# EAGLE design drone_parachute (EAGLE 9.5.0)
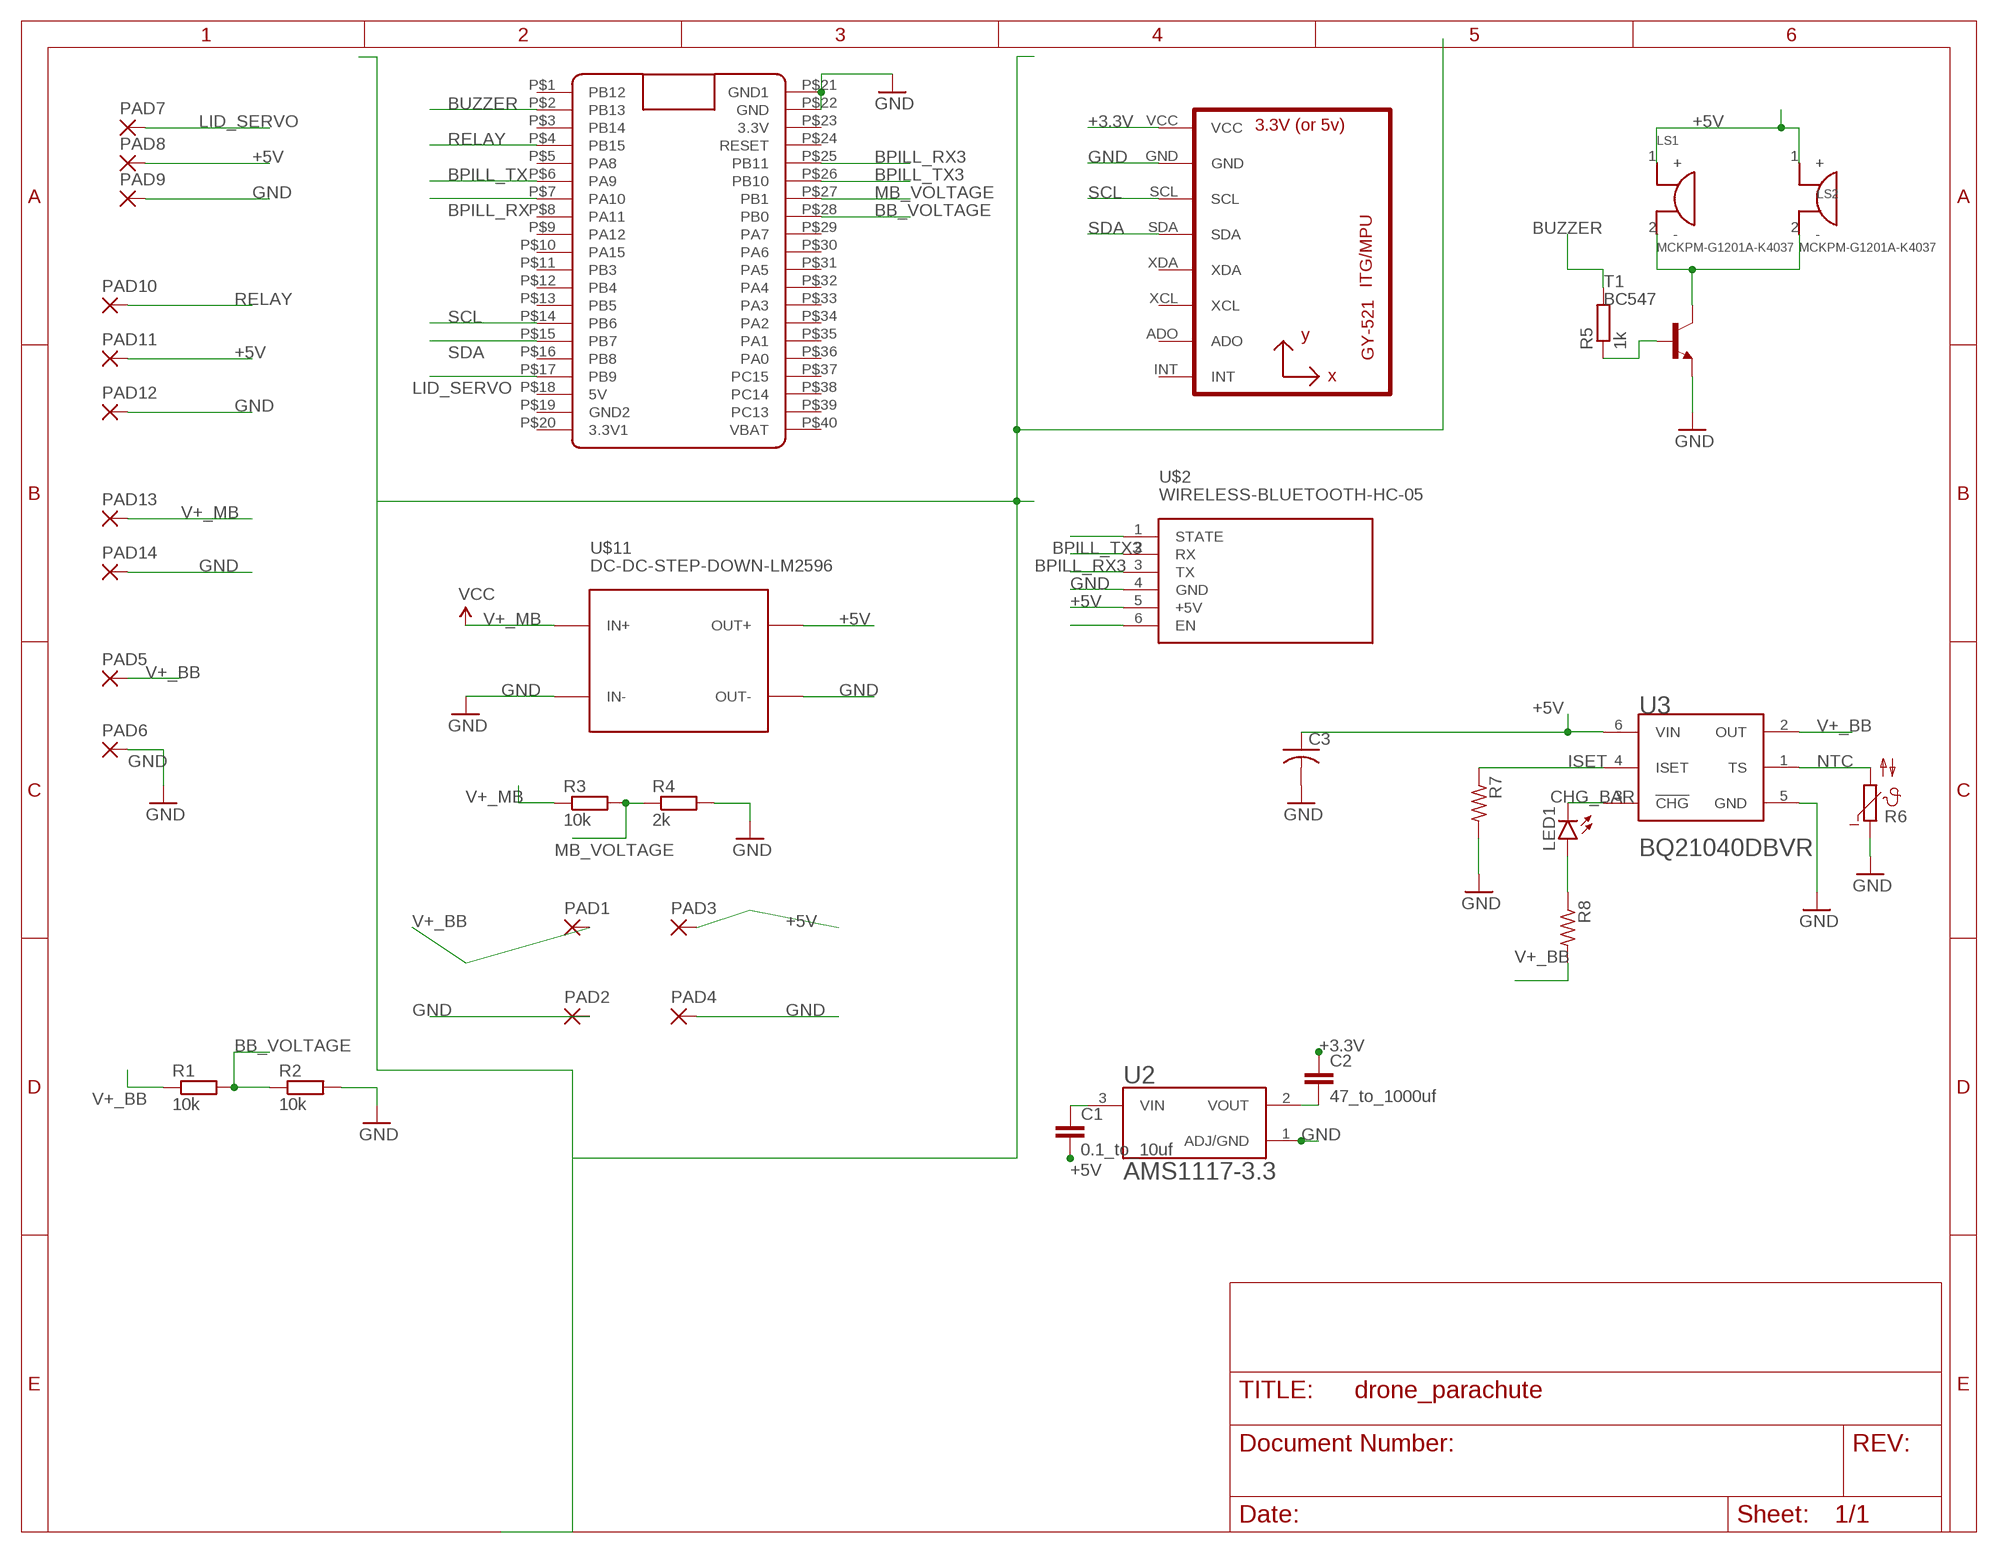
[diagram p0: schematic, sheet 1]

## Parts
C1  0.1_to_10uf  C-EU025-025X050  [C025-025X050]
C2  47_to_1000uf  C-EU025-025X050  [C025-025X050]
C3  C-USC0805  [C0805]
LED1  LEDCHIP-LED0805  [CHIP-LED0805]
LS1  MCKPM-G1201A-K4037  [XDCR_MCKPM-G1201A-K4037]
LS2  MCKPM-G1201A-K4037  [XDCR_MCKPM-G1201A-K4037]
PAD1  1,6/0,8  [1,6/0,8]
PAD2  1,6/0,8  [1,6/0,8]
PAD3  1,6/0,8  [1,6/0,8]
PAD4  1,6/0,8  [1,6/0,8]
PAD5  1,6/0,8  [1,6/0,8]
PAD6  1,6/0,8  [1,6/0,8]
PAD7  1,6/0,8  [1,6/0,8]
PAD8  1,6/0,8  [1,6/0,8]
PAD9  1,6/0,8  [1,6/0,8]
PAD10  1,6/0,8  [1,6/0,8]
PAD11  1,6/0,8  [1,6/0,8]
PAD12  1,6/0,8  [1,6/0,8]
PAD13  1,6/0,8  [1,6/0,8]
PAD14  1,6/0,8  [1,6/0,8]
R1  10k  R-EU_0204/7  [0204/7]
R2  10k  R-EU_0204/7  [0204/7]
R3  10k  R-EU_0204/7  [0204/7]
R4  2k  R-EU_0204/7  [0204/7]
R5  1k  R-EU_0204/7  [0204/7]
R6  NTC640  [P640]
R7  R-US_R0805  [R0805]
R8  R-US_R0805  [R0805]
T1  BC547  [TO92]
U1  GY-521MPU6050  [GY-521]
U2  AMS1117-3.3  [SOT229P700X180-4N]
U3  TEXAS_INSTRUMENTS_BQ21040DBVRTEXAS_INSTRUMENTS_BQ21040DBVR_0_0  [TEXAS_INSTRUMENTS_BQ21040DBVR_0]
U$1  BLUE_PILL  [BLUE_PILL]
U$2  WIRELESS-BLUETOOTH-HC-05  [WIRELESS-BLUETOOTH-HC-05]
U$11  DC-DC-STEP-DOWN-LM2596  [DC-DC-STEP-DOWN-LM2596]

## Nets
+3.3V: C2.1 U1.VCC
+5V: C1.2 C3.1 LS1.1(+) LS2.1(+) PAD3.1(P) PAD8.1(P) PAD11.1(P) U3.6(VIN) U$2.5(+5V) U$11.OUT+
BB_VOLTAGE: R1.2 R2.1 U$1.P$28(PB0)
BPILL_RX: U$1.P$7(PA10)
BPILL_RX3: U$1.P$25(PB11) U$2.3(TX)
BPILL_TX: U$1.P$6(PA9)
BPILL_TX3: U$1.P$26(PB10) U$2.2(RX)
BUZZER: R5.2 U$1.P$2(PB13)
CHG_BAR: LED1.C U3.3(!CHG!)
GND: C3.2 PAD2.1(P) PAD4.1(P) PAD6.1(P) PAD9.1(P) PAD12.1(P) PAD14.1(P) R2.2 R4.2 R6.1 R7.2 T1.1(E) U1.GND U2.1(ADJ/GND) U3.5(GND) U$1.P$21(GND1) U$1.P$22(GND) U$2.4(GND) U$11.IN- U$11.OUT-
ISET: R7.1 U3.4(ISET)
LID_SERVO: PAD7.1(P) U$1.P$17(PB9)
MB_VOLTAGE: R3.2 R4.1 U$1.P$27(PB1)
N$1: C1.1 U2.3(VIN)
N$3: U$2.1(STATE)
N$4: R5.1 T1.2(B)
N$5: C2.2 U2.2(VOUT)
N$10: U$2.6(EN)
N$13: LED1.A R8.1
N$31: LS1.2(-) LS2.2(-) T1.3(C)
NTC: R6.2 U3.1(TS)
RELAY: PAD10.1(P) U$1.P$4(PB15)
SCL: U1.SCL U$1.P$14(PB6)
SDA: U1.SDA U$1.P$15(PB7)
V+_BB: PAD1.1(P) PAD5.1(P) R1.1 R8.2 U3.2(OUT)
V+_MB: PAD13.1(P) R3.1 U$11.IN+ ; supply symbol labelled VCC
Unconnected: U1.ADO U1.INT U1.XCL U1.XDA U$1.P$1(PB12) U$1.P$3(PB14) U$1.P$5(PA8) U$1.P$8(PA11) U$1.P$9(PA12) U$1.P$10(PA15) U$1.P$11(PB3) U$1.P$12(PB4) U$1.P$13(PB5) U$1.P$16(PB8) U$1.P$18(5V) U$1.P$19(GND2) U$1.P$20(3.3V1) U$1.P$23(3.3V) U$1.P$24(RESET) U$1.P$29(PA7) U$1.P$30(PA6) U$1.P$31(PA5) U$1.P$32(PA4) U$1.P$33(PA3) U$1.P$34(PA2) U$1.P$35(PA1) U$1.P$36(PA0) U$1.P$37(PC15) U$1.P$38(PC14) U$1.P$39(PC13) U$1.P$40(VBAT)

## Library data of the parts
C1 C2 = rcl:C-EU: CAPACITOR, European symbol; SPICEPREFIX: C
C3 = rcl:C-US: CAPACITOR, American symbol; SPICEPREFIX: C
LED1 = led:LED: LED OSRAM: - CHIPLED LG R971, LG N971, LY N971, LG Q971, LY Q971, LO R971, LY R971 LH N974, LH R974 LS Q976, LO Q976, LY Q976 LO Q996 - Hyper CHIPLED LW Q18S LB Q993, LB Q99A, LB R99A - SideLED LS A670, LO A670, LY A670, LG A670, LP A670 LB A673, LV A673, LT A673, LW A673 LH A674 LY A675 LS A676, LA A676, LO A676, LY A676, LW A676 LS A679, LY A679, LG A679 - Hyper Micro SIDELED® LS Y876, LA Y876, LO Y876, LY Y876 LT Y87S - SmartLED LW L88C, LW L88S LB L89C, LB L89S, LG L890 LS L89K, LO L89K, LY L89K LS L896, LA L896, LO L896, LY L896 - TOPLED LS T670, LO T670, LY T670, LG T670, LP T670 LSG T670, LSP T670, LSY T670, LOP T670, LYG T670 LG T671, LOG T671, LSG T671 LB T673, LV T673, LT T673, LW T673 LH T674 LS T676, LA T676, LO T676, LY T676, LB T676, LH T676, LSB T676, LW T676 LB T67C, LV T67C, LT T67C, LS T67K, LO T67K, LY T67K, LW E67C LS E67B, LA E67B, LO E67B, LY E67B, LB E67C, LV E67C, LT E67C LW T67C LS T679, LY T679, LG T679 LS T770, LO T770, LY T770, LG T770, LP T770 LB T773, LV T773, LT T773, LW T773 LH T774 LS E675, LA E675, LY E675, LS T675 LS T776, LA T776, LO T776, LY T776, LB T776 LHGB T686 LT T68C, LB T68C - Hyper Mini TOPLED® LB M676 - Mini TOPLED Santana® LG M470 LS M47K, LO M47K, LY M47K Source: http://www.osram.convergy.de LUXEON: - LUMILED® LXK2-PW12-R00, LXK2-PW12-S00, LXK2-PW14-U00, LXK2-PW14-V00 LXK2-PM12-R00, LXK2-PM12-S00, LXK2-PM14-U00 LXK2-PE12-Q00, LXK2-PE12-R00, LXK2-PE12-S00, LXK2-PE14-T00, LXK2-PE14-U00 LXK2-PB12-K00, LXK2-PB12-L00, LXK2-PB12-M00, LXK2-PB14-N00, LXK2-PB14-P00, LXK2-PB14-Q00 LXK2-PR12-L00, LXK2-PR12-M00, LXK2-PR14-Q00, LXK2-PR14-R00 LXK2-PD12-Q00, LXK2-PD12-R00, LXK2-PD12-S00 LXK2-PH12-R00, LXK2-PH12-S00 LXK2-PL12-P00, LXK2-PL12-Q00, LXK2-PL12-R00 Source: www.luxeon.com KINGBRIGHT: KA-3528ASYC Source: www.kingbright.com
LS1 LS2 = buzzer:MCKPM-G1201A-K4037: Magnetic Buzzer And Transducer; AVAILABILITY: Unavailable; DESCRIPTION: Magnetic Buzzer And Transducer; MF: Multicomp; MP: MCKPM-G1201A-K4037; PACKAGE: None; PRICE: None
PAD1-PAD14 = wirepad:1,6/0,8: THROUGH-HOLE PAD
R1-R5 = rcl:R-EU_: RESISTOR, European symbol; SPICEPREFIX: R
R6 = ptc-ntc:NTC640: PHILIPS NTC
R7 R8 = rcl:R-US_: RESISTOR, American symbol; SPICEPREFIX: R
T1 = transistor:BC547: NPN TRANSISTOR
U1 = gy-521:GY-521
U2 = AMS1117-3.3:AMS1117-3.3: Sot223/Pkg 1-Amp 3.3-Volt Low Drop Out Voltage Regulatator; AVAILABILITY: Unavailable; DESCRIPTION: Sot223/Pkg 1-Amp 3.3-Volt Low Drop Out Voltage Regulatator; MF: Advanced Monolithic Systems; MP: AMS1117-3.3; PACKAGE: None; PRICE: None
U3 = Texas Instruments - BQ21040DBVR:TEXAS_INSTRUMENTS_BQ21040DBVR: IC BAT CHG LI-ION 1 CELL SOT23-6; CENTROID_NOT_SPECIFIED: No; DATASHEET: http://www.ti.com/lit/ds/symlink/bq21040.pdf; DIGIKEY_DESCRIPTION: IC BAT CHG LI-ION 1 CELL SOT23-6; DIGIKEY_PART_NUMBER: 296-47315-1-ND; LEAD_FREE: yes; MF: Texas Instruments; MFG_PACKAGE_IDENT: DBV0006B; MFG_PACKAGE_IDENT_DATE: 08/11; MFG_PACKAGE_IDENT_REV: C; MOUSER_DESCRIPTION: Battery Management 0.8A Single Input Single-Cell Li-Ion and Li-Pol Battery Charger 6-SOT-23 0 to 125; MOUSER_PART_NUMBER: 595-BQ21040DBVR; MPN: BQ21040DBVR; PACKAGE: SOT236; PREFIX: U; ROHS: yes; TEMPERATURE_RANGE_HIGH: +125°C; TEMPERATURE_RANGE_LOW: 0°C
U$1 = BluePill:BLUE_PILL
U$2 = diy-modules:WIRELESS-BLUETOOTH-HC-05: Bluetooth Transceiver Module based on HC-05 board Tutorial is available here: https://arduino-info.wikispaces.com/BlueTooth-HC05-HC06-Modules-How-To Click here to find device on ebay.com <http://www.ebay.com/sch/hc-05+module+rs232>
U$11 = diy-modules:DC-DC-STEP-DOWN-LM2596: DC/DC Step-Down Regulator based on LM2596-ADJ chip LM2596 datasheet available here: http://www.ti.com/lit/ds/symlink/lm2596.pdf Click here to find device on ebay.com <http://www.ebay.com/sch/lm2596+power+regulator>

## Board
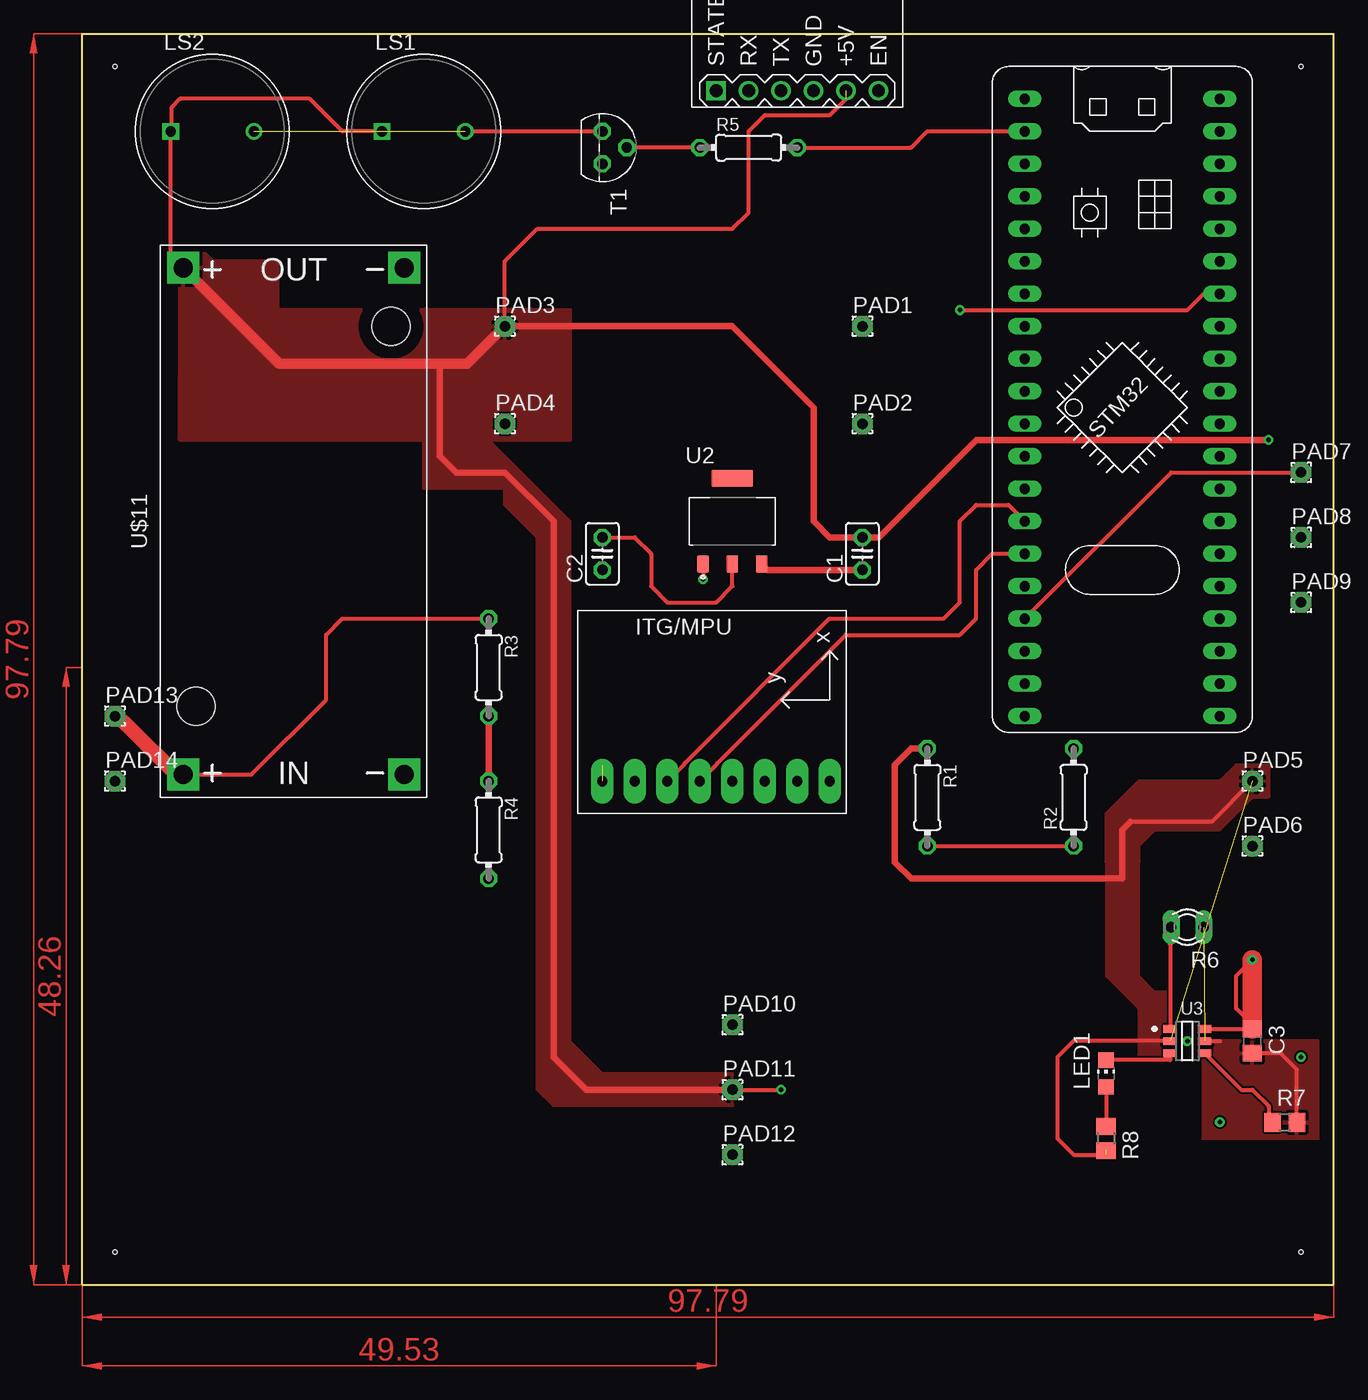
[diagram p1: board, top side]
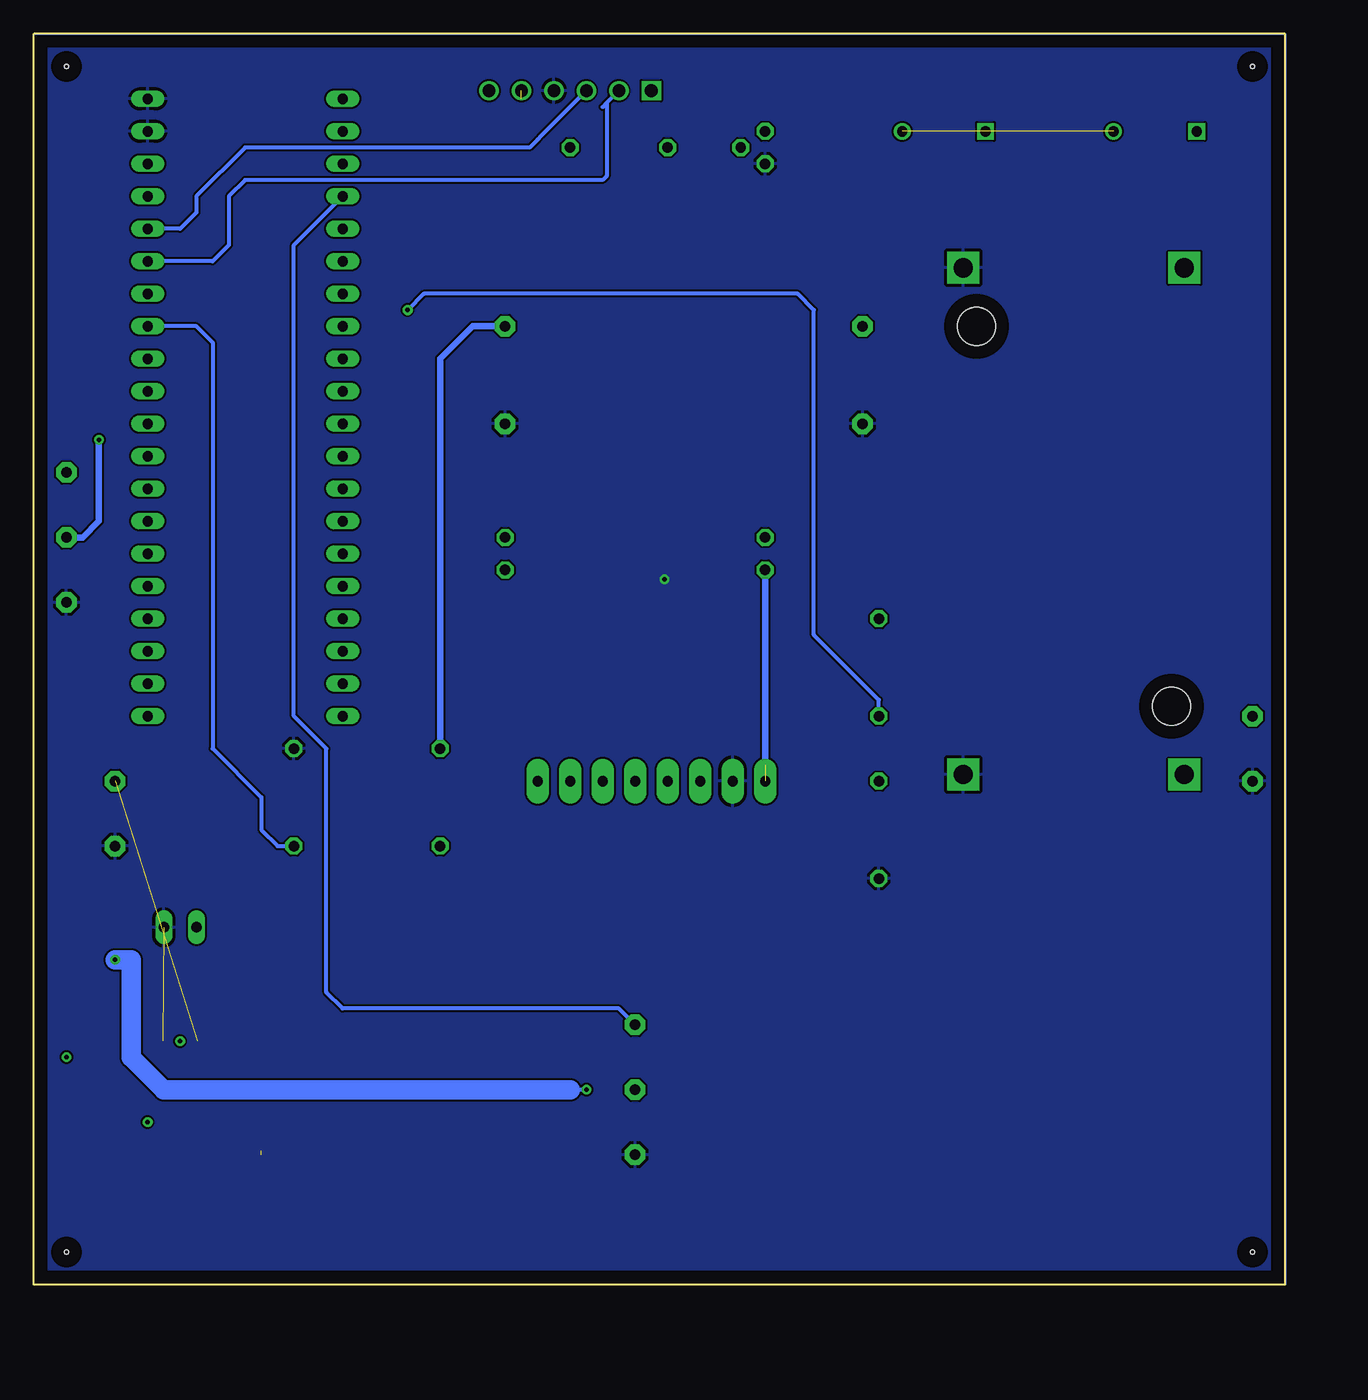
[diagram p2: board, bottom side, seen from below]

Size 97.79 x 97.79 mm. Coordinates in mm from the lower left corner, seen from the top.
Outline: 0,0 0,97.79 97.79,97.79 97.79,0 0,0
Copper layers (1*16): Top 0.035mm / dielectric 1.5mm / Bottom 0.035mm
Design rules "default *": minimum track width 12mil, minimum drill 0.35mm, track to track 6mil, track to pad 6mil, pad to pad 6mil, via to via 6mil, smd to smd 6mil, copper to edge 40mil, drill to drill 6mil, minimum pad ring 10mil, minimum via ring 8mil, stop-mask expansion 4mil, vias tented up to drill 0mil, thermal gap 10mil
Holes 0.35 mm at 2.54,2.54 95.25,2.54 95.25,95.25 2.54,95.25

### Footprints (pad centres in the part's own frame; a part is rotated, then mirrored left to right if it is on the bottom)
C025-025X050 = drill 0.813 octagon: 1 -1.27,0; 2 1.27,0
C0805 = smd 1.3 x 1.5: 1 -0.95,0; 2 0.95,0
CHIP-LED0805 = smd 1.2 x 1.2: A 0,-1.05; C 0,1.05
XDCR_MCKPM-G1201A-K4037 = drill 0.8 square: 1 -3.25,0 | drill 0.8: 2 3.25,0
1,6/0,8 = drill 0.813 pad 1.6 octagon: 1 0,0
0204/7 = drill 0.813 octagon: 1 -3.81,0; 2 3.81,0
P640 = drill 0.813 long: 1 -1.27,0; 2 1.27,0
R0805 = smd 1.3 x 1.5: 1 -0.95,0; 2 0.95,0
TO92 = drill 0.813 octagon: 1 1.27,0; 2 0,1.905; 3 -1.27,0
GY-521 = drill 0.8 pad 1.778 long: ADO -8.89,-6.35; GND -8.89,6.35; INT -8.89,-8.89; SCL -8.89,3.81; SDA -8.89,1.27; VCC -8.89,8.89; XCL -8.89,-3.81; XDA -8.89,-1.27
SOT229P700X180-4N = smd 0.93 x 1.31: 1 -2.29,-3.345; 2 0,-3.345; 3 2.29,-3.345 | smd 3.24 x 1.31: 4 0,3.345
TEXAS_INSTRUMENTS_BQ21040DBVR_0 = smd 0.6 x 1.05: 1 -0.95,-1.35; 2 0,-1.35; 3 0.95,-1.35; 4 0.95,1.35; 5 0,1.35; 6 -0.95,1.35 | smd 0.55 x 1: SMD_7 0.95,1.35; SMD_8 0,1.35; SMD_9 -0.95,1.35; SMD_10 -0.95,-1.35; SMD_11 0,-1.35; SMD_12 0.95,-1.35
BLUE_PILL = drill 0.8 long: P$1 -7.62,15.24; P$2 -7.62,12.7; P$3 -7.62,10.16; P$4 -7.62,7.62; P$5 -7.62,5.08; P$6 -7.62,2.54; P$7 -7.62,0; P$8 -7.62,-2.54; P$9 -7.62,-5.08; P$10 -7.62,-7.62; P$11 -7.62,-10.16; P$12 -7.62,-12.7; P$13 -7.62,-15.24; P$14 -7.62,-17.78; P$15 -7.62,-20.32; P$16 -7.62,-22.86; P$17 -7.62,-25.4; P$18 -7.62,-27.94; P$19 -7.62,-30.48; P$20 -7.62,-33.02; P$21 7.62,15.24; P$22 7.62,12.7; P$23 7.62,10.16; P$24 7.62,7.62; P$25 7.62,5.08; P$26 7.62,2.54; P$27 7.62,0; P$28 7.62,-2.54; P$29 7.62,-5.08; P$30 7.62,-7.62; P$31 7.62,-10.16; P$32 7.62,-12.7; P$33 7.62,-15.24; P$34 7.62,-17.78; P$35 7.62,-20.32; P$36 7.62,-22.86; P$37 7.62,-25.4; P$38 7.62,-27.94; P$39 7.62,-30.48; P$40 7.62,-33.02
WIRELESS-BLUETOOTH-HC-05 = drill 1 square: 1 -6.35,-17.145 | drill 1: 2 -3.81,-17.145; 3 -1.27,-17.145; 4 1.27,-17.145; 5 3.81,-17.145; 6 6.35,-17.145
DC-DC-STEP-DOWN-LM2596 = drill 1.5 pad 2.5 square: IN+ -19.812,8.636; IN- -19.812,-8.636; OUT+ 19.812,8.636; OUT- 19.812,-8.636 | hole 3: -14.478,7.62; 15.24,-7.62

### Placement (x,y rotation side)
C1  60.96,57.15 90 top
C2  40.64,57.15 90 top
C3  91.44,19.05 270 top
LED1  80.01,16.51 0 top
LS1  26.67,90.17 0 top
LS2  10.16,90.17 0 top
PAD1  60.96,74.93 0 top
PAD2  60.96,67.31 0 top
PAD3  33.02,74.93 0 top
PAD4  33.02,67.31 0 top
PAD5  91.44,39.37 0 top
PAD6  91.44,34.29 0 top
PAD7  95.25,63.5 0 top
PAD8  95.25,58.42 0 top
PAD9  95.25,53.34 0 top
PAD10  50.8,20.32 0 top
PAD11  50.8,15.24 0 top
PAD12  50.8,10.16 0 top
PAD13  2.54,44.45 0 top
PAD14  2.54,39.37 0 top
R1  66.04,38.1 270 top
R2  77.47,38.1 90 top
R3  31.75,48.26 270 top
R4  31.75,35.56 270 top
R5  52.07,88.9 0 top
R6  86.36,27.94 180 top
R7  93.98,12.7 0 top
R8  80.01,11.43 270 top
T1  40.64,88.9 270 top
U1  49.53,48.26 90 top
U2  50.8,59.69 0 top
U3  86.36,19.05 270 top
U$1  81.28,77.47 0 top
U$2  55.88,110.49 0 top
U$11  16.51,59.69 90 top

### Tracks (layer width: path | path; a pad name or v marks a point on that pad's centre or on a via)
+3.3V  (1 unrouted)
  Bottom 0.508: C2.1 40.64,40.64
+5V  (via drill 0.35)  (1 unrouted)
  Top 0.305: U$11.OUT+ 6.91,80.47 LS2.1 6.99,90.24 6.99,92.08 7.62,92.71 17.78,92.71 20.32,90.17 LS1.1 | 32.38,74.3 PAD3.1 33.02,80.01 35.56,82.55 50.8,82.55 52.07,83.82 52.07,90.17 53.34,91.44 58.42,91.44 59.69,92.71 | U3.6 C3.1 | PAD11.1 v54.61,15.24 | 91.44,20.32 90.17,21.59 90.17,24.13 v91.44,25.4
  Top 0.508: PAD3.1 50.8,74.93 57.15,68.58 57.15,59.69 58.42,58.42 C1.2 62.23,58.42 69.85,66.04 v92.71,66.04 | 27.94,72.01 27.94,64.77 29.21,63.5 33.02,63.5 36.83,59.69 36.83,17.78 39.37,15.24 PAD11.1
  Top 0.813: U$11.OUT+ 15.37,72.01 27.94,72.01 30.1,72.01 PAD3.1
  Top 1.524: v91.44,25.4 C3.1
  Bottom 0.305: v54.61,15.24 55.88,15.24
  Bottom 0.508: v92.71,66.04 92.71,59.69 93.98,58.42 PAD8.1
  Bottom 1.524: 55.88,15.24 87.63,15.24 90.17,17.78 90.17,25.4 v91.44,25.4
  pour Top: 8.89,81.28 7.62,80.01 7.62,71.12 34.29,71.12 35.56,76.2 13.97,76.2 11.43,78.74
  pour Top: 8.89,80.01 15.24,80.01 15.24,76.2 38.1,76.2 38.1,66.04 7.62,66.04 7.62,71.12 8.89,72.39
  pour Top: 50.8,13.97 36.83,13.97 35.56,15.24 35.56,35.56 35.56,58.42 33.02,60.96 33.02,62.23 26.67,62.23 26.67,67.31 30.48,67.31 38.1,59.69 38.1,19.05 39.37,17.78 40.64,16.51 50.8,16.51
BB_VOLTAGE
  Top 0.305: R1.2 R2.1
  Bottom 0.305: U$1.P$28 85.09,74.93 83.82,73.66 83.82,41.91 80.01,38.1 80.01,35.56 78.74,34.29 R2.1
BPILL_RX3
  Bottom 0.305: U$2.3 58.1,89.85 58.42,89.53 59.05,88.9 81.28,88.9 85.09,85.09 85.09,83.82 86.36,82.55 U$1.P$25
BPILL_TX3
  Bottom 0.305: U$2.2 53.02,92.39 | 53.34,92.08 53.02,92.39 | 53.02,92.39 53.02,86.68 53.34,86.36 81.28,86.36 82.55,85.09 82.55,81.28 83.82,80.01 U$1.P$26
BUZZER
  Top 0.305: R5.2 64.77,88.9 66.04,90.17 U$1.P$2
CHG_BAR
  Top 0.305: 84.69,17.78 U3.3 85.01,17.56 LED1.C
GND  (via drill 0.35)  (1 unrouted)
  Top 0.305: U2.1 v48.51,55.16 | C3.2 93.66,18.1 94.93,16.83 R7.2 | U3.5 88.9,19.05
  Bottom 0.152: 0,97.79 0,0 97.79,0 97.79,97.79 0,97.79
  pour Bottom: 0,97.79 0,0 97.79,0 97.79,97.79
  pour Top: 87.63,13.97 87.63,19.05 95.25,19.05 96.52,19.05 96.52,11.43 87.63,11.43
  pour Bottom: 0,97.79 0,0 97.79,0 97.79,97.79
ISET
  Top 0.305: U3.4 90.57,15.24 91.44,15.24 92.71,13.97 92.71,12.7 R7.1
LID_SERVO
  Top 0.305: U$1.P$17 85.09,63.5 PAD7.1
MB_VOLTAGE  (via drill 0.35)
  Top 0.305: U$1.P$27 87.63,77.47 86.36,76.2 v68.58,76.2
  Top 0.508: R4.1 R3.2
  Bottom 0.305: R3.2 31.75,45.72 36.83,50.8 36.83,76.2 38.1,77.47 67.31,77.47 v68.58,76.2
N$1
  Top 0.508: U2.3 53.55,55.88 C1.1
N$4
  Top 0.305: R5.1 T1.2
N$5
  Top 0.305: C2.2 43.18,58.42 44.45,57.15 44.45,54.61 45.72,53.34 49.53,53.34 50.8,54.61 U2.2
N$6  (via drill 0.35)
  other vias: 86.36,19.05
N$7  (via drill 0.35)
  other vias: 95.25,17.78
N$11  (via drill 0.35)
  other vias: 88.9,12.7
N$13
  Top 0.305: LED1.A R8.1
N$31  (1 unrouted)
  Top 0.305: LS1.2 T1.3
NTC
  Top 0.305: U3.1 85.01,26.59 85.09,26.67 R6.2
RELAY
  Bottom 0.305: PAD10.1 52.07,21.59 73.66,21.59 74.93,22.86 74.93,41.91 77.47,44.45 77.47,81.28 U$1.P$4
SCL
  Top 0.305: U1.SCL 47.07,40.72 47.07,40.75 58.38,52.07 67.31,52.07 68.58,53.34 68.58,59.69 69.85,60.96 72.39,60.96 U$1.P$14
SDA
  Top 0.305: U1.SDA 49.61,40.72 49.61,40.75 59.65,50.8 68.58,50.8 69.85,52.07 69.85,55.88 71.12,57.15 U$1.P$15
V+_BB  (2 unrouted)
  Top 0.305: U3.2 77.47,19.05 76.2,17.78 76.2,11.43 77.47,10.16 80.01,10.16 | PAD5.1 88.27,36.2 81.92,36.2
  Top 0.508: R1.1 64.77,41.91 63.5,40.64 63.5,33.02 64.77,31.75 81.28,31.75 81.28,35.56 81.92,36.2
  Bottom 0.508: R1.1 66.04,72.39 63.5,74.93 PAD1.1
  pour Top: 82.55,21.59 82.55,17.78 83.82,16.51 86.36,16.51 86.36,22.86 83.82,22.86 82.55,24.13 82.55,33.02 80.01,33.02 80.01,24.13
  pour Top: 80.01,33.02 80.01,36.83 82.55,39.37 88.9,39.37 90.17,40.64 91.44,40.64 82.55,35.56 82.55,33.02
  pour Top: 91.44,40.64 92.71,40.64 92.71,38.1 91.44,38.1 88.9,35.56 83.82,35.56 82.55,34.29 82.55,33.02 80.01,33.02 80.01,36.83 82.55,39.37 88.9,39.37 90.17,40.64
V+_MB
  Top 0.305: 3.56,44.2 3.3,44.45 PAD13.1 | U$11.IN+ 13.21,39.88 19.05,45.72 19.05,50.8 20.32,52.07 R3.1
  Top 0.406: 3.56,44.2 U$11.IN+
  Top 0.813: PAD13.1 7.62,39.37
(copper drawn outside any net)
  shapes: Top area x5